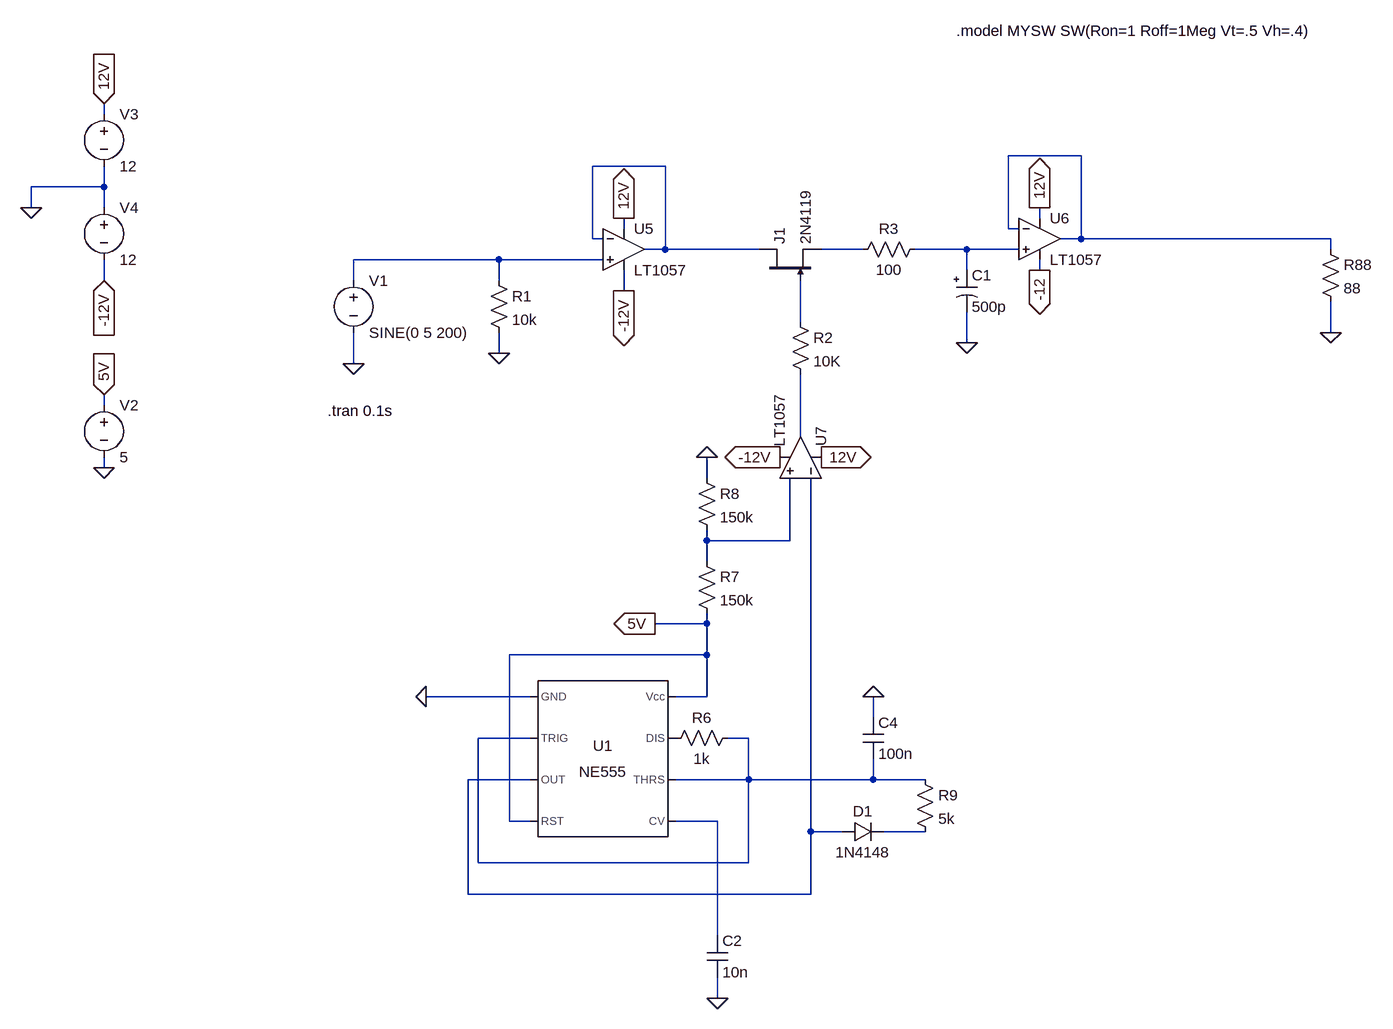
[diagram p0: schematic Sample_Hold.asc]
Sample_Hold.asc, the LTspice schematic file:
Version 4
SHEET 1 1052 1348
WIRE -912 -112 -912 -128
WIRE 592 -48 480 -48
WIRE -48 -32 -160 -32
WIRE -912 0 -912 -32
WIRE -912 0 -1024 0
WIRE -1024 32 -1024 0
WIRE -912 32 -912 0
WIRE 528 48 528 32
WIRE -112 64 -112 48
WIRE 480 64 480 -48
WIRE 496 64 480 64
WIRE -160 80 -160 -32
WIRE -144 80 -160 80
WIRE 592 80 592 -48
WIRE 592 80 560 80
WIRE 976 80 592 80
WIRE -48 96 -48 -32
WIRE -48 96 -80 96
WIRE 96 96 -48 96
WIRE 256 96 192 96
WIRE 416 96 336 96
WIRE 496 96 416 96
WIRE 976 96 976 80
WIRE -304 112 -528 112
WIRE -144 112 -304 112
WIRE 416 128 416 96
WIRE 528 128 528 112
WIRE -912 144 -912 112
WIRE -528 144 -528 112
WIRE -304 144 -304 112
WIRE -112 160 -112 128
WIRE 160 208 160 144
WIRE 976 224 976 176
WIRE 416 240 416 192
WIRE -304 256 -304 224
WIRE -528 272 -528 224
WIRE -912 336 -912 320
WIRE 160 384 160 288
WIRE -912 432 -912 416
WIRE 16 448 16 416
WIRE 16 544 16 528
WIRE 144 544 144 448
WIRE 144 544 16 544
WIRE 16 576 16 544
WIRE 16 672 16 656
WIRE 16 672 -64 672
WIRE 16 720 16 672
WIRE 16 720 -288 720
WIRE -256 784 -416 784
WIRE 16 784 16 720
WIRE 16 784 -32 784
WIRE 272 816 272 784
WIRE -256 848 -336 848
WIRE 80 848 48 848
WIRE -256 912 -352 912
WIRE 80 912 80 848
WIRE 80 912 -32 912
WIRE 272 912 272 880
WIRE 272 912 80 912
WIRE 352 912 272 912
WIRE -288 976 -288 720
WIRE -256 976 -288 976
WIRE 32 976 -32 976
WIRE 176 992 176 448
WIRE 224 992 176 992
WIRE 352 992 288 992
WIRE -336 1040 -336 848
WIRE 80 1040 80 912
WIRE 80 1040 -336 1040
WIRE -352 1088 -352 912
WIRE 176 1088 176 992
WIRE 176 1088 -352 1088
WIRE 32 1152 32 976
WIRE 32 1248 32 1216
FLAG -304 256 0
FLAG 416 240 0
FLAG 976 224 0
FLAG -528 272 0
FLAG -1024 32 0
FLAG -912 -128 12V
IOPIN -912 -128 In
FLAG -912 144 -12V
IOPIN -912 144 In
FLAG -112 48 12V
IOPIN -112 48 Out
FLAG 528 32 12V
IOPIN 528 32 Out
FLAG -112 160 -12V
IOPIN -112 160 Out
FLAG 528 128 -12
IOPIN 528 128 Out
FLAG 192 416 12V
IOPIN 192 416 Out
FLAG 128 416 -12V
IOPIN 128 416 Out
FLAG -912 432 0
FLAG -912 320 5V
IOPIN -912 320 In
FLAG -64 672 5V
IOPIN -64 672 Out
FLAG 16 416 0
FLAG -416 784 0
FLAG 272 784 0
FLAG 32 1248 0
DATAFLAG -912 0 ""
SYMBOL res -320 128 R0
SYMATTR InstName R1
SYMATTR Value 10k
SYMBOL voltage -528 128 R0
WINDOW 123 0 0 Left 2
WINDOW 39 0 0 Left 2
SYMATTR InstName V1
SYMATTR Value SINE(0 5 200)
SYMBOL res 960 80 R0
SYMATTR InstName R88
SYMATTR Value 88
SYMBOL voltage -912 -128 R0
WINDOW 123 0 0 Left 2
WINDOW 39 0 0 Left 2
SYMATTR InstName V3
SYMATTR Value 12
SYMBOL voltage -912 16 R0
WINDOW 123 0 0 Left 2
WINDOW 39 0 0 Left 2
SYMATTR InstName V4
SYMATTR Value 12
SYMBOL polcap 400 128 R0
WINDOW 3 24 56 Left 2
SYMATTR Value 500p
SYMATTR InstName C1
SYMATTR Description Capacitor
SYMATTR Type cap
SYMATTR SpiceLine V=50 Irms=2 Rser=0.041 Lser=0 mfg="Panasonic" pn="ECA1HFQ102S" type="Al electrolytic"
SYMBOL res 352 80 R90
WINDOW 0 0 56 VBottom 2
WINDOW 3 32 56 VTop 2
SYMATTR InstName R3
SYMATTR Value 100
SYMATTR SpiceLine tol=1 pwr=0.1
SYMBOL njf 96 144 R270
SYMATTR InstName J1
SYMATTR Value 2N4119
SYMBOL res 144 192 R0
SYMATTR InstName R2
SYMATTR Value 10K
SYMATTR SpiceLine tol=1 pwr=0.1
SYMBOL Misc\\NE555 -144 880 R0
SYMATTR InstName U1
SYMBOL voltage -912 320 R0
SYMATTR InstName V2
SYMATTR Value 5
SYMBOL res 0 432 R0
SYMATTR InstName R8
SYMATTR Value 150k
SYMBOL res 0 560 R0
SYMATTR InstName R7
SYMATTR Value 150k
SYMBOL res 64 832 R90
WINDOW 0 0 56 VBottom 2
WINDOW 3 32 56 VTop 2
SYMATTR InstName R6
SYMATTR Value 1k
SYMBOL res 336 896 R0
SYMATTR InstName R9
SYMATTR Value 5k
SYMBOL diode 224 1008 R270
WINDOW 0 32 32 VTop 2
WINDOW 3 0 32 VBottom 2
SYMATTR InstName D1
SYMATTR Value 1N4148
SYMBOL cap 256 816 R0
SYMATTR InstName C4
SYMATTR Value 100n
SYMBOL cap 16 1152 R0
SYMATTR InstName C2
SYMATTR Value 10n
SYMBOL Opamps\\LT1057 -112 32 R0
SYMATTR InstName U5
SYMBOL Opamps\\LT1057 528 16 R0
SYMATTR InstName U6
SYMBOL Opamps\\LT1057 224 416 M270
SYMATTR InstName U7
TEXT -568 344 Left 2 !.tran 0.1s
TEXT 400 -240 Left 2 !.model MYSW SW(Ron=1 Roff=1Meg Vt=.5 Vh=.4)

The netlist it stands for:
* Sample_Hold.asc
R1 N005 0 10k
V1 N005 0 SINE(0 5 200)
R88 N001 0 88
V3 12V 0 12
V4 0 -12V 12
C1 N004 0 500p V=50 Irms=2 Rser=0.041 Lser=0 mfg="Panasonic" pn="ECA1HFQ102S" type="Al electrolytic"
R3 N004 N003 100 tol=1 pwr=0.1
J1 N002 N006 N003 2N4119
R2 N006 N007 10K tol=1 pwr=0.1
XU1 0 N009 N010 5V N011 N009 P001 5V NE555  ; pins GND TRIG OUT RST CV THRS DIS Vcc
V2 5V 0 5
R8 0 N008 150k
R7 N008 5V 150k
R6 N009 P001 1k
R9 N009 N012 5k
D1 N010 N012 1N4148
C4 0 N009 100n
C2 N011 0 10n
XU5 N005 N002 12V -12V N002 LT1057  ; pins In+ In- V+ V- OUT
XU6 N004 N001 12V -12 N001 LT1057  ; pins In+ In- V+ V- OUT
XU7 N008 N010 12V -12V N007 LT1057  ; pins In+ In- V+ V- OUT
.model D D
.lib standard.dio
.model NJF NJF
.model PJF PJF
.lib standard.jft
.tran 0.1s
.model MYSW SW(Ron=1 Roff=1Meg Vt=.5 Vh=.4)
.lib NE555.sub
.lib LTC.lib
.backanno
.end